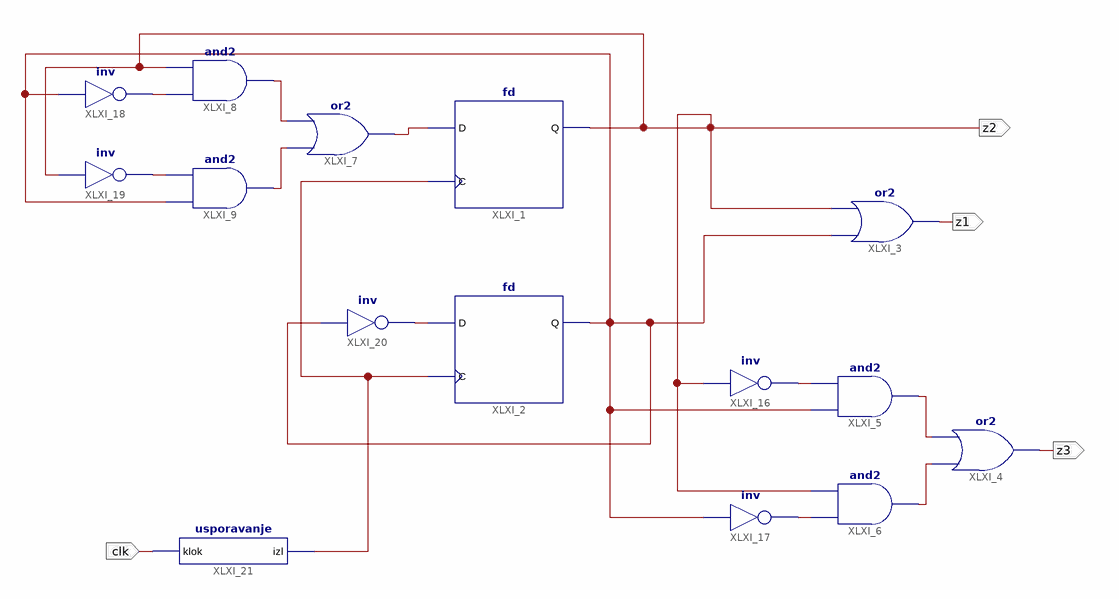
[diagram p0: schematic sheet 1]
// Xilinx ISE schematic glavna.sch (spartan3e) as structural Verilog: 15 symbols, 4 ports
module glavna (
  input  clk,
  output z2,
  output z1,
  output z3
);

  wire XLXN_1, XLXN_2, XLXN_6, XLXN_8, XLXN_14, XLXN_25, XLXN_26, XLXN_31, XLXN_32, XLXN_37, XLXN_38, XLXN_39;

  fd XLXI_1 (.C(XLXN_39), .D(XLXN_14), .Q(z2));
  fd XLXI_2 (.C(XLXN_39), .D(XLXN_37), .Q(XLXN_38));
  or XLXI_3 (z1, XLXN_38, z2);
  and XLXI_9 (XLXN_8, XLXN_38, XLXN_32);
  and XLXI_8 (XLXN_6, XLXN_31, z2);
  or XLXI_7 (XLXN_14, XLXN_8, XLXN_6);
  or XLXI_4 (z3, XLXN_2, XLXN_1);
  and XLXI_5 (XLXN_1, XLXN_38, XLXN_25);
  and XLXI_6 (XLXN_2, XLXN_26, z2);
  not XLXI_16 (XLXN_25, z2);
  not XLXI_17 (XLXN_26, XLXN_38);
  not XLXI_18 (XLXN_31, XLXN_38);
  not XLXI_19 (XLXN_32, z2);
  not XLXI_20 (XLXN_37, XLXN_38);
  usporavanje XLXI_21 (.izl(XLXN_39), .klok(clk));
endmodule
